# Altium schematic sheet TDA 2050 - 32W DON.SchDoc
size A; SheetNumber: 1; SheetTotal: 1
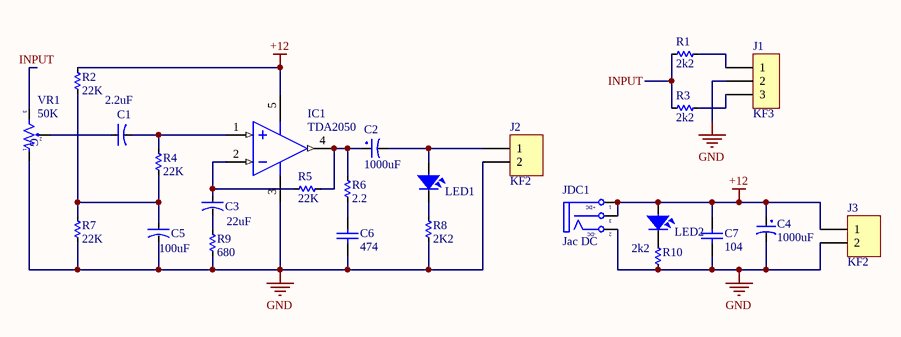
[diagram p0: TDA 2050 - 32W DON.SchDoc]

## Parts
C1  2.2uF  [CA-ALU-5]
C2  1000uF  [tu hoa 13mm]
C3  22uF  [CA-ALU-5]
C4  1000uF  [tu hoa 13mm]
C5  100uF  [CA-ALU-5]
C6  474  [tu gom]
C7  104  [tu gom]
IC1  TDA2050  [DIP5]
J1  KF3  [KF3-5.08]
J2  KF2  [KF2-5.08]
J3  KF2  [KF2-5.08]
JDC1  Jac DC  [DC0]
LED1  LED  [LED-5-RED]  (value not drawn)
LED2  LED  [LED-5-BLUE]  (value not drawn)
R1  2k2  [RES-1/4W-SMALL]
R2  22K  [RES-1/4W-SMALL]
R3  2k2  [RES-1/4W-SMALL]
R4  22K  [RES-1/4W-SMALL]
R5  22K  [RES-1/4W-SMALL]
R6  2.2  [RES-1/4W-SMALL]
R7  22K  [RES-1/4W-SMALL]
R8  2K2  [RES-1/4W-SMALL]
R9  680  [RES-1/4W-SMALL]
R10  2k2  [RES-1/4W-SMALL]
VR1  50K  [VR-S1]

## Nets
+12: C4.1 C7.1 IC1.5(V+) J3.1 JDC1.1(T) JDC1.3(S) LED2.1 R2.1
GND: C4.2 C5.2 C6.2 C7.2 IC1.3(V-) J1.2 J2.2 J3.2 JDC1.2(TN) R7.2 R8.2 R9.2 R10.2 VR1.1
INPUT: R1.1 R3.2 VR1.3
NetC1_1: C1.1 VR1.2
NetC1_2: C1.2 IC1.1(IN+) R4.1
NetC2_1: C2.1 IC1.4(OUT) R5.2 R6.1
NetC2_2: C2.2 J2.1 LED1.1
NetC3_1: C3.1 IC1.2(IN-) R5.1
NetC3_2: C3.2 R9.1
NetC5_1: C5.1 R2.2 R4.2 R7.1
NetC6_1: C6.1 R6.2
NetJ1_1: J1.1 R1.2
NetJ1_3: J1.3 R3.1
NetLED1_2: LED1.2 R8.1
NetLED2_2: LED2.2 R10.1

## Notes on the sheet
- (in symbol DCIN) +DC; -DC
- (in symbol VR-S) G

## Library data of the parts
C1 C3 C5 = CN-ALU-DIP: Capacitor (Semiconductor SIM Model); Value: 104; LatestRevisionDate: 17-Jul-2002; LatestRevisionNote: Re-released for DXP Platform.; PackageReference: C1206; Publisher: Altium Limited
C2 C4 = Tu Hoa 1000uF 50V 13x26: Cắm; Don_Vi: Con; So_Chan: 2; Ten_Linh_Kien: Tụ Hóa 1000uF 50V; Ma_Hang: MH006619; Chung_Loai: Cắm; Kieu_Chan: *
C6 C7 = Tu gom 104 50V: Cắm; So_Chan: 2; Ten_Linh_Kien: Tụ gốm 104 100nF 50V; Don_Vi: Con; Ma_Hang: MH004761; Chung_Loai: Cắm; Kieu_Chan: *
IC1 = TDA2050: Value: TDA2030
J1 = KF3: Manufacturer: Würth Elektronik eiSos GmbH; partNo: 691103110003; ComponentLink1 Description: Manufacturer; ComponentLink2 Description: Datasheet; NoPins: 3; Created Date: 29 October 2013; ComponentLink1URL: http://www.we-online.com; ComponentLink2URL: http://katalog.we-online.de/em/datasheet/6911031100xx.pdf; Created by: Karrer Zheng
J2 J3 = KF2: Manufacturer: Würth Elektronik eiSos GmbH; partNo: 691103110002; ComponentLink1 Description: Manufacturer; ComponentLink2 Description: Datasheet; NoPins: 2; Created Date: 29 October 2013; ComponentLink1URL: http://www.we-online.com; ComponentLink2URL: http://katalog.we-online.de/em/datasheet/6911031100xx.pdf; Created by: Karrer Zheng
JDC1 = DCIN: Jac DC input; Value: Jac DC
LED1 LED2 = LED: LED Single colour Green and Red; Value: LED 3 ly Single Colour
R1-R10 = Res: Manufacturer: Generic Components; Class: Passive; SubClass: R; Published: 08/06/2000; Publisher: Altium Hobart Technology Centre
VR1 = VR-S: Var Resistor; Value: Volume 50k